# EasyEDA Pro project ProPrj_EIS-HW-V01_test_2026-05-23.epro, board PCB1
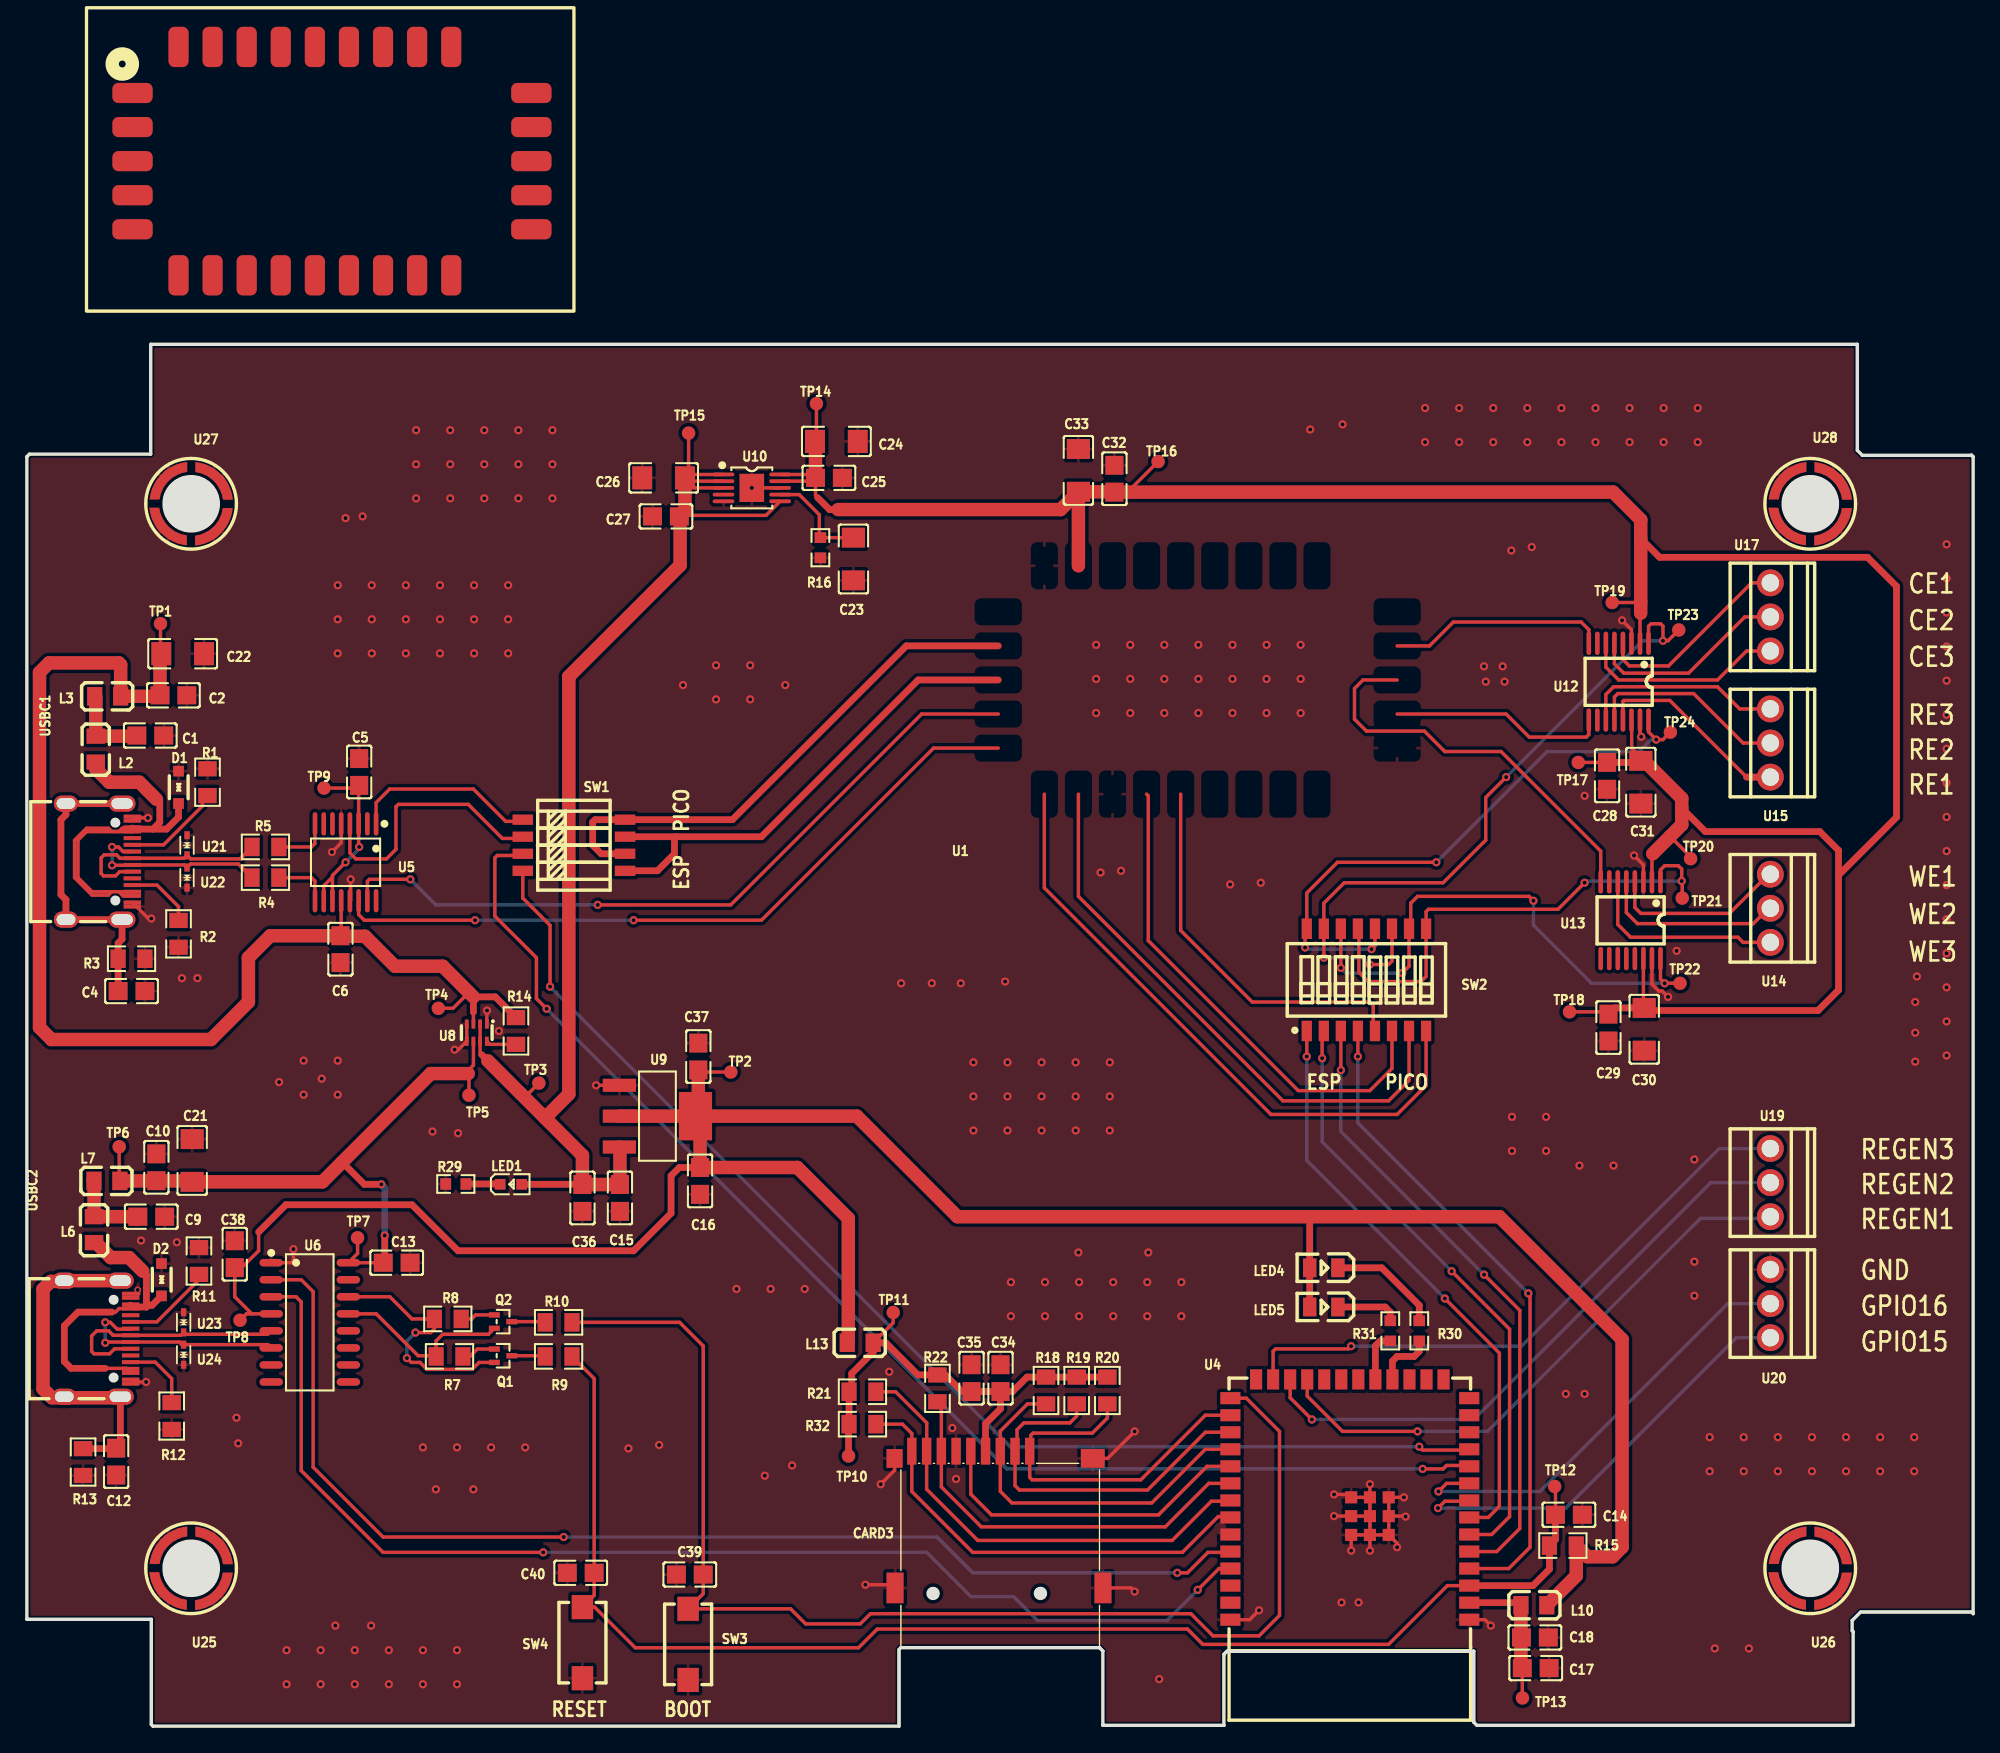
[diagram p5: board, top side]
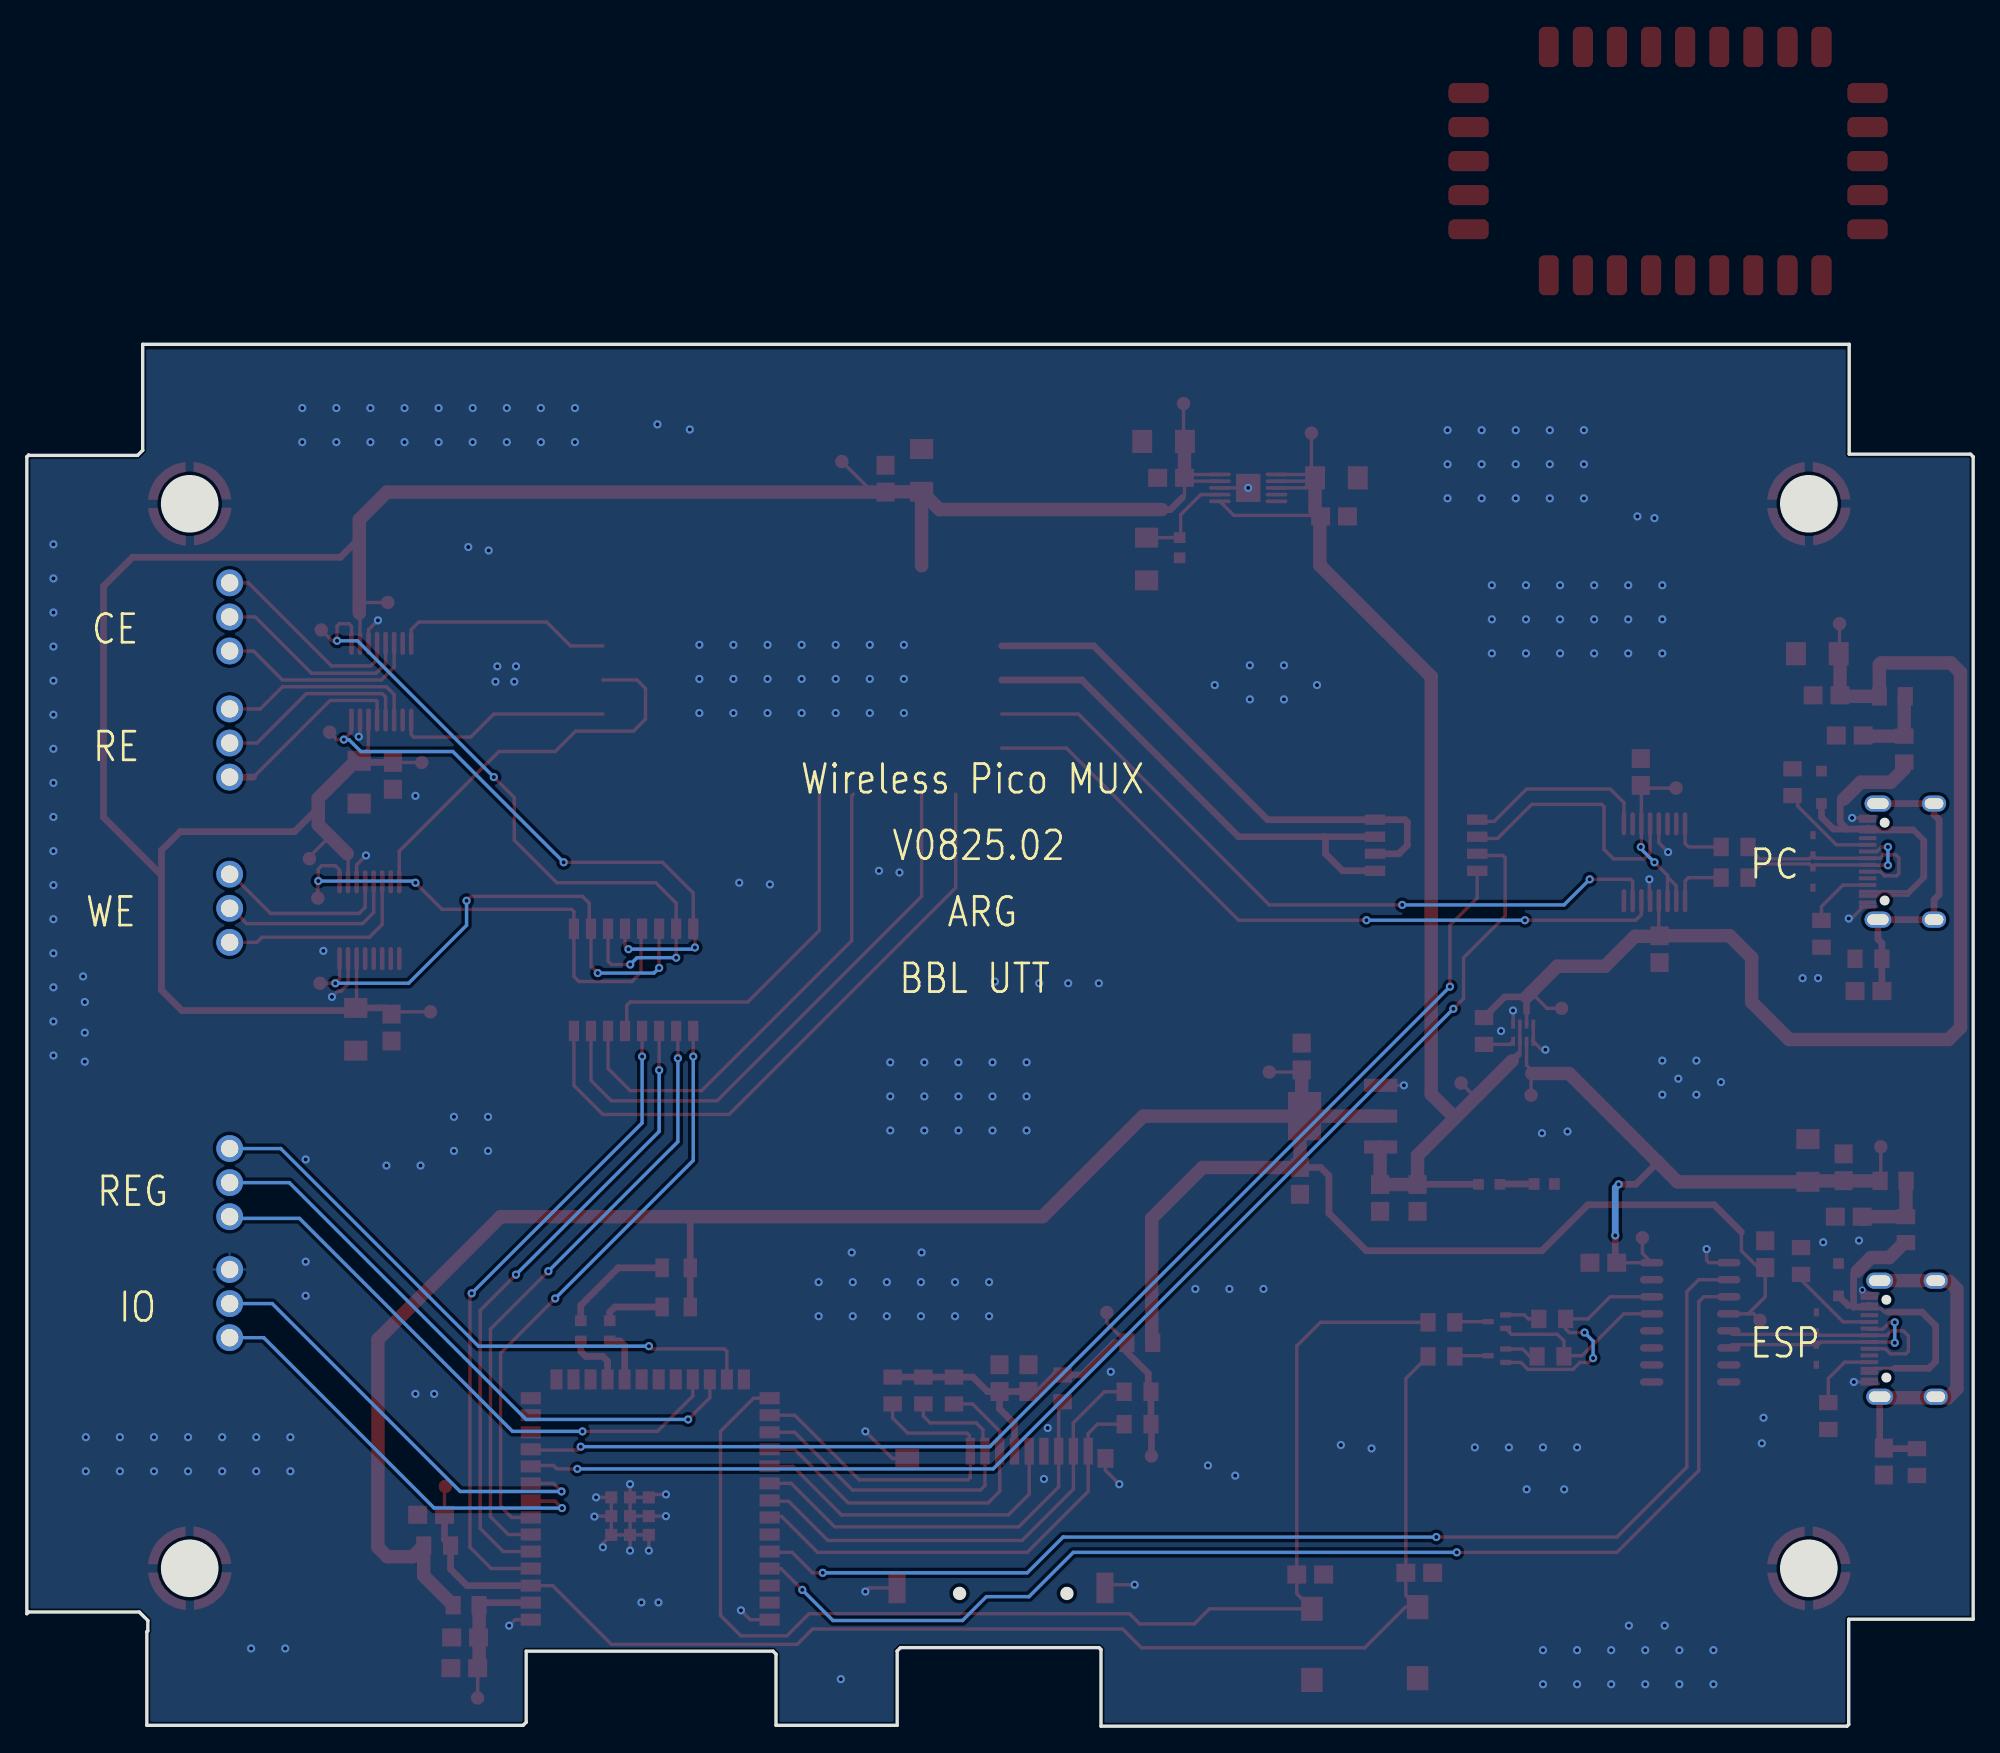
[diagram p6: board, bottom side, seen from below]

Outline 145.03 x 103 mm; copper layers: Top Layer, Bottom Layer. Coordinates in mm from the lower left corner of the outline.
Outline path: 0,94.62 0,7.97 9.27,7.97 9.27,0.13 9.4,0 64.99,0 64.99,5.71 65.13,5.85 79.93,5.85 80.18,5.6 80.18,0.06 89.21,0.06 89.21,5.36 89.43,5.59 107.82,5.59 107.82,0.29 108.05,0.06 136.09,0.06 136.09,7.04 136.02,7.11 136.02,7.87 136.65,8.51 144.91,8.51 145.03,8.38 145.03,94.62 144.91,94.74 144.88,94.72 136.78,94.72 136.4,95.1 136.4,103 9.23,103 9.23,94.81 0.19,94.81 0,94.62
Stack: Top Layer 0.035mm / Dielectric1 1.51mm FR4 er 4.5 / Bottom Layer 0.035mm

## Design rules (mm)
template: JLCPCB Capability(Two Layers Board)
spacing copperThickness1oz (default): track to track 0.102, other pairs 0.152 to 0.3
spacing copperThickness2oz: track to track 0.203, other pairs 0.152 to 0.3
track width copperThickness1oz (default): min 0.127, default 0.254, max 2.54
track width copperThickness2oz: min 0.203, default 0.254, max 2.54
differential pair differentialPair (default): width min 0.127, default 0.254, max 2.54; gap min 0.152, default 0.152
via viaSize (default): diameter min 0.5, default 0.61, max 10; hole min 0.3, default 0.305, max 6.3

## Placement (name value [footprint] x y rotation side)
C1  1uF  [C0805]  9.2 73.84 180 top
C2  100nF  [C0805]  10.92 76.84 180 top
C4  100nF  [C0805]  7.8 54.79 0 top
C5  100nF  [C0805]  24.77 71.12 270 top
C6  100nF  [C0805]  23.37 57.91 90 top
C9  1uF  [C0805]  9.27 37.97 180 top
C10  100nF  [C0805]  9.65 41.66 270 top
C12  100nF  [C0805]  6.66 19.72 270 top
C13  100nF  [C0805]  27.56 34.54 180 top
C14  1uF  [C0805]  114.91 15.76 180 top
C15  1uF  [C0805]  44.2 39.37 90 top
C16  4.7uF  [C0805]  50.16 40.64 90 top
C17  100nF  [C0805]  112.44 4.33 180 top
C18  10uF  [C0805]  112.37 6.61 180 top
C21  10uF  [C1206]  12.32 42.16 270 top
C22  10uF  [C1206]  11.61 79.94 180 top
C23  10uF  [C1206]  61.59 87 90 top
C24  22uF  [C1206]  60.32 95.76 180 top
C25  100nF  [C0805]  59.77 93.04 180 top
C26  10uF  [C1206]  47.45 93.04 0 top
C27  100nF  [C0805]  47.62 90.17 0 top
C28  100nF  [C0805]  117.75 70.83 90 top
C29  100nF  [C0805]  117.86 52.07 90 top
C30  10uF  [C1206]  120.52 51.94 90 top
C31  10uF  [C1206]  120.27 70.36 90 top
C32  100nF  [C0805]  81.04 92.98 90 top
C33  10uF  [C1206]  78.36 93.6 270 top
C34  100nF  [C0805]  72.55 25.94 270 top
C35  10uF  [C0805]  70.4 25.94 270 top
C36  100nF  [C0805]  41.4 39.37 90 top
C37  100nF  [C0805]  50.04 49.91 270 top
C38  100nF  [C0805]  15.49 35.18 270 top
C39  100nF  [C0805]  49.4 11.3 0 top
C40  100nF  [C0805]  41.28 11.43 0 top
CARD3  TF-015  [TF-SMD_TF-015]  72.43 15.4 0 top
D1  PESD5V0S1BA,115  [SOD-323_L1.7-W1.3-LS2.5-BI]  11.3 69.98 270 top
D2  PESD5V0S1BA,115  [SOD-323_L1.7-W1.3-LS2.5-BI]  10.03 33.27 270 top
L2  MPZ2012S601ATD25  [L0805]  5.14 72.82 90 top
L3  MPZ2012S601ATD25  [L0805]  6.02 76.76 0 top
L6  MPZ2012S601ATD25  [L0805]  5.01 37.01 90 top
L7  MPZ2012S601ATD25  [L0805]  5.97 40.64 0 top
L10  MPZ2012S601ATD25  [L0805]  112.3 9.02 180 top
L13  MPZ2012S601ATD25  [L0805]  62.1 28.58 0 top
LED1  KT-0603R  [LED0603-RD]  36.07 40.39 0 top
LED4  KT-0805Y  [LED0805-R-RD]  96.65 34.16 180 top
LED5  KT-0805G  [LED0805-R-RD]  96.65 31.24 180 top
Q1  MMBT2222ATT1G  [SC-75-3_L1.6-W0.8-P1.00-LS1.6-BR]  35.49 27.61 180 top
Q2  MMBT2222ATT1G  [SC-75-3_L1.6-W0.8-P1.00-LS1.6-BR]  35.49 30.15 180 top
R1  5.1kΩ  [R0805]  13.46 70.36 270 top
R2  5.1kΩ  [R0805]  11.3 59.06 90 top
R3  100kΩ  [R0805]  7.8 57.2 0 top
R4  27Ω  [R0805]  17.78 63.25 0 top
R5  27Ω  [R0805]  17.78 65.53 0 top
R7  10kΩ  [R0805]  31.5 27.56 0 top
R8  10kΩ  [R0805]  31.37 30.35 0 top
R9  0Ω  [R0805]  39.62 27.56 0 top
R10  0Ω  [R0805]  39.62 30.1 0 top
R11  5.1kΩ  [R0805]  12.83 34.67 270 top
R12  5.1kΩ  [R0805]  10.8 23.11 90 top
R13  100kΩ  [R0805]  4.19 19.69 270 top
R14  10kΩ  [R0805]  36.45 51.82 90 top
R15  10kΩ  [R0805]  114.46 13.46 0 top
R16  40kΩ  [R0603]  59.13 87.84 90 top
R18  10kΩ  [R0805]  75.95 25.02 90 top
R19  10kΩ  [R0805]  78.23 25.02 90 top
R20  10kΩ  [R0805]  80.52 25.02 90 top
R21  10kΩ  [R0805]  62.27 24.92 180 top
R22  10kΩ  [R0805]  67.85 25.18 90 top
R29  1kΩ  [R0603]  31.97 40.41 0 top
R30  1kΩ  [R0603]  103.76 29.46 90 top
R31  1kΩ  [R0603]  101.6 29.46 90 top
R32  10kΩ  [R0805]  62.27 22.51 180 top
SW1  DSHP04TSGET  [SW-SMD_8P-L6.7-W5.4-P1.27-LS8.4]  40.77 65.66 270 top
SW2  DSHP08TSGET  [SW-SMD_DSHP08TSGET]  99.82 55.63 0 top
SW3  SKQMBBE010  [KEY-SMD_L6.0-W3.5-LS6.2]  49.28 6.1 270 top
SW4  SKQMBBE010  [KEY-SMD_L6.0-W3.5-LS6.2]  41.4 6.22 270 top
TP1  -  [Test-Point-0.5mm]  9.96 82.17 0 top
TP2  -  [Test-Point-0.5mm]  52.46 48.76 0 top
TP3  -  [Test-Point-0.5mm]  38.16 47.93 0 top
TP4  -  [Test-Point-0.5mm]  30.67 53.5 0 top
TP5  -  [Test-Point-0.5mm]  32.95 47.03 0 top
TP6  -  [Test-Point-0.5mm]  6.88 43.19 0 top
TP7  -  [Test-Point-0.5mm]  24.65 36.4 0 top
TP8  -  [Test-Point-0.5mm]  15.89 30.25 0 top
TP9  -  [Test-Point-0.5mm]  22.14 69.92 0 top
TP10  -  [Test-Point-0.5mm]  61.23 20.14 0 top
TP11  -  [Test-Point-0.5mm]  64.56 30.83 0 top
TP12  -  [Test-Point-0.5mm]  113.85 17.87 0 top
TP13  -  [Test-Point-0.5mm]  111.45 2.1 0 top
TP14  -  [Test-Point-0.5mm]  58.84 98.58 270 top
TP15  -  [Test-Point-0.5mm]  49.31 96.38 270 top
TP16  -  [Test-Point-0.5mm]  84.3 94.26 0 top
TP17  -  [Test-Point-0.5mm]  115.61 71.83 0 top
TP18  -  [Test-Point-0.5mm]  114.96 53.24 0 top
TP19  -  [Test-Point-0.5mm]  118.14 83.75 0 top
TP20  -  [Test-Point-0.5mm]  123.98 64.66 0 top
TP21  -  [Test-Point-0.5mm]  123.35 61.72 0 top
TP22  -  [Test-Point-0.5mm]  123.19 55.37 0 top
TP23  -  [Test-Point-0.5mm]  123.1 81.71 0 top
TP24  -  [Test-Point-0.5mm]  122.47 74.09 270 top
U1  EmStat Pico  [Emstat-Pico]  72.39 72.9 0 top
U4  2.4GHz  [WIFIM-SMD_ESP32-S3-WROOM-1-N8]  98.58 16.89 180 top
U5  FT230XS-U  [SSOP-16_L5.0-W4.4-P0.65-LS6.4-BL]  23.75 64.39 180 top
U6  CH340C  [SOP-16_L10.0-W3.9-P1.27-LS6.0-BL]  21.08 30.1 270 top
U8  LM66200DRLR  [SOT-583-8_L2.1-W1.2-P0.50-LS1.6-BL]  33.53 51.69 180 top
U9  LDL1117S33R  [SOT-223-4_L6.5-W3.5-P2.30-LS7.0-BR]  46.99 45.47 180 top
U10  LT3042EMSE#TRPBF  [MSOP-10_L3.0-W3.0-P0.50-LS5.0-BL-EP]  54.02 92.29 270 top
U12  TMUX1109PWR  [TSSOP-16_L5.0-W4.4-P0.64-LS6.4-BL]  118.62 77.85 180 top
U13  TMUX1109PWR  [TSSOP-16_L5.0-W4.4-P0.64-LS6.4-BL]  119.51 60.07 180 top
U14  KF128-2.54-3P  [CONN-TH_3P-P2.54_KF128-2.54-3P]  129.92 60.96 90 top
U15  KF128-2.54-3P  [CONN-TH_3P-P2.54_KF128-2.54-3P]  129.92 73.28 90 top
U17  KF128-2.54-3P  [CONN-TH_3P-P2.54_KF128-2.54-3P]  129.92 82.68 90 top
U19  KF128-2.54-3P  [CONN-TH_3P-P2.54_KF128-2.54-3P]  129.92 40.51 90 top
U20  KF128-2.54-3P  [CONN-TH_3P-P2.54_KF128-2.54-3P]  129.92 31.5 90 top
U21  BNLESD5D5.0CT1G  [SOD-523_L1.2-W0.8-LS1.6-BI]  11.94 65.66 270 top
U22  BNLESD5D5.0CT1G  [SOD-523_L1.2-W0.8-LS1.6-BI]  11.94 63.25 90 top
U23  BNLESD5D5.0CT1G  [SOD-523_L1.2-W0.8-LS1.6-BI]  11.68 30.1 270 top
U24  BNLESD5D5.0CT1G  [SOD-523_L1.2-W0.8-LS1.6-BI]  11.68 27.69 90 top
U25  PAD_D3.3_M3Screw_1  [SMD_BD5.5-D3.9]  12.24 11.77 0 top
U26  PAD_D3.3_M3Screw_1  [SMD_BD5.5-D3.9]  132.89 11.77 0 top
U27  PAD_D3.3_M3Screw_1  [SMD_BD5.5-D3.9]  12.24 91.11 0 top
U28  PAD_D3.3_M3Screw_1  [SMD_BD5.5-D3.9]  132.89 91.11 0 top
USBC1  TYPE-C-31-M-12  [USB-C_SMD-TYPE-C-31-M-12]  5.39 64.44 270 top
USBC2  TYPE-C-31-M-12  [USB-C_SMD-TYPE-C-31-M-12]  5.26 28.88 270 top

## Footprints (pads in the part's own frame, mm; a bottom-side part is the same pattern mirrored in y, then rotated)
C0805
  rect 1.41x1.35 smd: 1(-1,0) 2(1,0)
C1206
  rect 1.485x1.728 smd: 1(-1.593,0) 2(1.593,0)
CONN-TH_3P-P2.54_KF128-2.54-3P
  round 2 hole 1.3: 1(-2.54,0) 2(0,0) 3(2.54,0)
Emstat-Pico
  rrect 3x1.5 smd: 1(-64.516,48.831) 2(-64.516,46.291) 3(-64.516,43.752) 4(-64.516,41.212) 5(-64.516,38.672) 15(-34.796,38.672) 16(-34.796,41.212) 17(-34.796,43.752) 18(-34.796,46.291) 19(-34.796,48.831)
  rrect 1.5x3 smd: 6(-61.087,35.242) 7(-58.547,35.242) 8(-56.007,35.242) 9(-53.467,35.242) 10(-50.926,35.242) 11(-48.386,35.242) 12(-45.846,35.242) 13(-43.306,35.242) 14(-40.767,35.242) 20(-40.767,52.261) 21(-43.306,52.261) 22(-45.846,52.261) 23(-48.386,52.261) 24(-50.926,52.261) 25(-53.467,52.261) 26(-56.007,52.261) 27(-58.547,52.261) 28(-61.087,52.261)
KEY-SMD_L6.0-W3.5-LS6.2
  rect 1.8x1.6 smd: 1(-2.65,0) 2(2.65,0)
L0805
  rect 1.133x1.377 smd: 1(-0.966,0) 2(0.966,0)
LED0603-RD
  rect 0.8x0.8 smd: 1(-0.799,0) 2(0.799,0)
LED0805-R-RD
  rect 1x1.399 smd: 1(1.05,0) 2(-1.05,0)
MSOP-10_L3.0-W3.0-P0.50-LS5.0-BL-EP
  oval 0.28x1.62 smd: 1(-1,-2.11) 2(-0.5,-2.11) 3(0,-2.11) 4(0.5,-2.11) 5(1,-2.11) 6(1,2.11) 7(0.5,2.11) 8(0,2.11) 9(-0.5,2.11) 10(-1,2.11)
  rect 2.1x1.83 smd: 11(0,0)
R0603
  rect 0.806x0.864 smd: 1(-0.753,0) 2(0.753,0)
R0805
  rect 1.133x1.377 smd: 1(-1,0) 2(1,0)
SC-75-3_L1.6-W0.8-P1.00-LS1.6-BR
  rect 0.816x0.4 smd: 1(0.65,-0.5) 2(0.65,0.5) 3(-0.65,0)
SMD_BD5.5-D3.9
  custom 0x0 smd: 1(-1.714,-2.131) 1(-1.691,2.155) 1(1.701,-2.155) 1(1.714,2.141)
SOD-323_L1.7-W1.3-LS2.5-BI
  rect 0.8x0.8 smd: 1(-1.205,0) 2(1.205,0)
SOD-523_L1.2-W0.8-LS1.6-BI
  rect 0.6x0.4 smd: 1(-0.75,0) 2(0.75,0)
SOP-16_L10.0-W3.9-P1.27-LS6.0-BL
  oval 0.56x1.745 smd: 1(-4.445,-2.873) 2(-3.175,-2.873) 3(-1.905,-2.873) 4(-0.635,-2.873) 5(0.635,-2.873) 6(1.905,-2.873) 7(3.175,-2.873) 8(4.445,-2.873) 9(4.445,2.873) 10(3.175,2.873) 11(1.905,2.873) 12(0.635,2.873) 13(-0.635,2.873) 14(-1.905,2.873) 15(-3.175,2.873) 16(-4.445,2.873)
SOT-223-4_L6.5-W3.5-P2.30-LS7.0-BR
  rect 2.47x0.98 smd: 1(2.835,-2.3) 2(2.835,0) 3(2.835,2.3)
  rect 2.47x3.6 smd: 4(-2.835,0)
SOT-583-8_L2.1-W1.2-P0.50-LS1.6-BL
  rect 0.28x0.68 smd: 1(-0.75,-0.64) 2(-0.25,-0.64) 3(0.25,-0.64) 4(0.75,-0.64) 5(0.75,0.64) 6(0.25,0.64) 7(-0.25,0.64) 8(-0.75,0.64)
SSOP-16_L5.0-W4.4-P0.65-LS6.4-BL
  oval 0.343x1.732 smd: 1(-2.275,-2.866) 2(-1.625,-2.866) 3(-0.975,-2.866) 4(-0.325,-2.866) 5(0.325,-2.866) 6(0.975,-2.866) 7(1.625,-2.866) 8(2.275,-2.866) 9(2.275,2.866) 10(1.625,2.866) 11(0.975,2.866) 12(0.325,2.866) 13(-0.325,2.866) 14(-0.975,2.866) 15(-1.625,2.866) 16(-2.275,2.866)
SW-SMD_8P-L6.7-W5.4-P1.27-LS8.4
  rect 0.762x1.524 smd: 1(-1.905,-3.81) 2(-0.635,-3.81) 3(0.635,-3.81) 4(1.905,-3.81) 5(1.905,3.81) 6(0.635,3.81) 7(-0.635,3.81) 8(-1.905,3.81)
SW-SMD_DSHP08TSGET
  rect 0.762x1.524 smd: 1(-4.445,-3.81) 2(-3.175,-3.81) 3(-1.905,-3.81) 4(-0.635,-3.81) 5(0.635,-3.81) 6(1.905,-3.81) 7(3.175,-3.81) 8(4.445,-3.81) 9(4.445,3.81) 10(3.175,3.81) 11(1.905,3.81) 12(0.635,3.81) 13(-0.635,3.81) 14(-1.905,3.81) 15(-3.175,3.81) 16(-4.445,3.81)
Test-Point-0.5mm
  round 1 smd: 1(0,0)
TF-SMD_TF-015
  rect 0.7x2 smd: 1(2.303,5.095) 2(1.21,5.093) 3(0.113,5.095) 4(-0.987,5.095) 5(-2.085,5.095) 6(-3.183,5.095) 7(-4.28,5.095) 8(-5.378,5.095) 9(-6.482,5.095)
  rect 1.2x1.397 smd: 10(-7.764,4.557)
  rect 1.27x2.286 smd: 11(-7.729,-5.095) 12(7.764,-5.095)
  rect 1.778x1.397 smd: 13(7.003,4.557)
TSSOP-16_L5.0-W4.4-P0.64-LS6.4-BL
  oval 0.343x1.732 smd: 1(-2.226,-2.862) 2(-1.59,-2.862) 3(-0.954,-2.862) 4(-0.318,-2.862) 5(0.318,-2.862) 6(0.954,-2.862) 7(1.59,-2.862) 8(2.226,-2.862) 9(2.226,2.862) 10(1.59,2.862) 11(0.954,2.862) 12(0.318,2.862) 13(-0.318,2.862) 14(-0.954,2.862) 15(-1.59,2.862) 16(-2.226,2.862)
USB-C_SMD-TYPE-C-31-M-12
  oval 1.2x2 hole 0.8x1.6: 0(-4.325,1.706) 1(4.325,1.706)
  oval 1.2x1.8 hole 0.8x1.4: 2(4.325,-2.474) 3(-4.325,-2.474)
  rect 0.3x1.3 smd: A1(-3.35,2.474) A4(-2.55,2.474) A5(-1.25,2.474) A6(-0.25,2.474) A7(0.25,2.474) A8(1.25,2.474) A9(2.55,2.474) A12(3.35,2.474) B1(3.05,2.474) B4(2.25,2.474) B5(1.75,2.474) B6(0.75,2.474) B7(-0.75,2.474) B8(-1.75,2.474) B9(-2.25,2.474) B12(-3.05,2.474)
WIFIM-SMD_ESP32-S3-WROOM-1-N8
  rect 1.5x0.9 smd: 1(-8.9,8.954) 2(-8.9,7.684) 3(-8.9,6.415) 4(-8.9,5.144) 5(-8.9,3.874) 6(-8.9,2.604) 7(-8.9,1.335) 8(-8.9,0.065) 9(-8.9,-1.206) 10(-8.9,-2.475) 11(-8.9,-3.745) 12(-8.9,-5.016) 13(-8.9,-6.285) 14(-8.9,-7.556) 27(8.9,-7.556) 28(8.9,-6.285) 29(8.9,-5.016) 30(8.9,-3.745) 31(8.9,-2.475) 32(8.9,-1.206) 33(8.9,0.065) 34(8.9,1.335) 35(8.9,2.604) 36(8.9,3.874) 37(8.9,5.144) 38(8.9,6.415) 39(8.9,7.684) 40(8.9,8.954)
  rect 0.9x1.5 smd: 15(-6.985,-8.954) 16(-5.715,-8.954) 17(-4.445,-8.954) 18(-3.175,-8.954) 19(-1.905,-8.954) 20(-0.635,-8.954) 21(0.635,-8.954) 22(1.905,-8.954) 23(3.175,-8.954) 24(4.445,-8.954) 25(5.715,-8.954) 26(6.985,-8.954)
  rect 0.9x0.9 smd: 41(-2.9,2.635) 41(-2.9,1.235) 41(-2.9,-0.165) 41(-1.5,2.635) 41(-1.5,1.235) 41(-1.5,-0.165) 41(-0.1,2.635) 41(-0.1,1.235) 41(-0.1,-0.165)

## Nets
As in the schematic.

Pads without a net: U1 1 11 12 13 14 19 20 21 22 23 24 25 26; U4 12 13 14 15 16 17 20 21 22 26 35 38 39; U5 2 6 7 16; U6 7 8 9 10 11 12 15; U10 4; U12 7 10; U13 7 9 10 11 12 13; USBC1 A8 B8; USBC2 A8 B8

## Via types
v1: diameter 0.61, hole 0.305, Top Layer to Bottom Layer, 299 vias
v2: diameter 0.5, hole 0.3, Top Layer to Bottom Layer, 1 via

## Routing (per net, layer and track width the routed paths; a pad name or vN(x,y) marks a point on that pad's centre or on a via; arc(x,y) is an arc through that point)
+3V3: length 194.6
  Top Layer w0.254: 16.76,30.73 16.37,30.73 TP8.1 ; 16.76,30.73 18.21,30.73 ; 16.76,30.73 15.49,32 C38.2 16.02,34.18 17.27,35.43 17.27,36.83 ; C37.2 50.19,48.76 TP2.1
  Top Layer w0.5: 17.27,36.83 19.3,38.86 28.7,38.86 32.13,35.43 45.21,35.43 48.01,38.23 48.01,41.02 48.62,41.64 C16.2 ; LED5.1 LED4.1 95.6,37.82 95.75,37.97
  Top Layer w1: U9.4 50.16,45.13 50.16,41.77 ; U9.4 61.85,45.47 69.34,37.97 109.73,37.97 118.87,28.83 118.87,13.34 118.16,12.63 116.29,12.63 R15.2 115.46,11.21 L10.1 ; U9.4 50.04,45.68 C37.2 ; U9.4 U9.2 ; C16.2 57.42,41.64 61.21,37.85 61.21,28.65 L13.1
+4V: length 209.6
  Top Layer w0.254: TP14.1 58.84,95.86 C24.2 ; TP17.1 C28.2 ; U13.14 120.46,53.6 ; TP16.1 82.02,91.98 ; U10.9 58.27,92.79 58.77,93.29 U10.10 ; C29.2 117.68,53.24 TP18.1 ; U13.2 121.1,64.96 ; C25.2 58.77,91.73 58.93,91.57 ; 120.26,83.8 120.22,83.75 TP19.1 ; 122.45,66.32 123.98,64.79 TP20.1 ; 120.27,72.2 119.59,72.89 119.59,74.98 U12.14 ; U12.2 120.21,82.88 120.27,82.94
  Top Layer w0.5: 135,63.42 135,54.86 133.48,53.34 120.72,53.34 C30.2 118.32,53.54 C29.2 ; 135,63.42 139.32,67.74 139.32,84.96 137.16,87.12 121.67,87.12 120.01,88.77 ; 135,63.42 135,65.28 133.6,66.68 125.08,66.68 123.32,68.44 ; 120.26,82.95 120.27,82.94 ; 120.27,72.2 119.9,71.83 C28.2 ; 58.93,91.57 59.82,90.68 60.45,90.68
  Top Layer w1: C24.2 58.77,95.72 C25.2 ; 120.26,82.95 120.26,89.92 118.21,91.98 C32.1 81.02,92.01 C33.2 77.03,90.68 60.45,90.68 ; 120.27,72.2 123.32,69.16 123.32,67.18 121.16,65.02 ; 78.36,86.49 78.36,92.01
+5V: length 98.3
  Top Layer w0.254: 49.29,93.29 49.31,93.31 TP15.1 ; 49.29,93.29 C26.2 ; 49.29,93.29 U10.1 ; 36.77,47.18 37.4,47.18 TP3.1 ; U10.2 49.29,92.79 49.79,92.29 U10.3 ; U10.6 55.09,90.25 48.7,90.25 ; U8.2 U8.7 33.78,50.04
  Top Layer w0.5: LED1.2 41.39,40.39 C36.2 ; 33.91,50.04 34.35,49.59
  Top Layer w1: U9.3 44.2,43.13 C15.2 C36.2 41.4,42.55 38.61,45.34 ; 34.35,49.59 38.61,45.34 ; C26.2 49.04,90.59 C27.2 ; 38.61,45.34 40.39,47.11 40.39,78.23 48.68,86.53 48.68,90.17
+5V_USB1: length 94.3
  Top Layer w0.254: U5.12 23.42,58.97 C6.2 ; 32.94,54.69 31.75,53.5 TP4.1 ; U8.3 33.28,53.21 ; C22.2 9.96,80 TP1.1
  Top Layer w0.5: 33.27,54.36 34.91,54.36 R14.2 ; 33.28,53.21 33.28,54.35
  Top Layer w1: 9.72,76.76 L3.2 6.99,79.12 6.86,79.25 1.65,79.25 0.94,78.54 0.94,52.07 1.83,51.18 13.72,51.18 16.51,53.98 16.51,57.28 18.14,58.91 C6.2 23.41,58.87 25.2,58.87 27.43,56.64 30.99,56.64 33.27,54.36 ; C22.2 9.92,79.84 C2.2
+5V_USB2: length 50.4
  Top Layer w0.254: TP5.1 32.95,48.93 33.28,49.26 U8.6 ; 6.94,40.64 6.88,40.69 TP6.1 ; TP7.1 24.65,35.24 U6.16 26.43,34.54
  Top Layer w0.5: v1(26.67,36.58) 26.67,34.66 C13.2 ; 32.89,48.64 32.89,48.66 32.95,48.71 ; 23.5,42.04 25.15,40.39 v1(26.42,40.39)
  Top Layer w1: 6.94,40.64 12.25,40.64 C21.2 22.03,40.57 30.1,48.64 32.89,48.64
  Bottom Layer w0.5: v1(26.67,36.58) 26.67,40.13 v1(26.42,40.39)
GND: length 64.2
  Top Layer w0.254: 64.7,10.3 64.46,10.54 v1(62.48,10.54) ; v1(97.41,17.27) 98.47,17.27 U4.41 U4.41 ; U12.15 120.21,73.84 v1(120.3,73.75) ; CARD3.12 82.28,10.3 v1(82.55,10.03) ; v1(34.29,53.34) 34.28,53.33 U8.1 ; USBC2.B1 7.91,25.65 v1(8.89,25.65) ; U4.41 102.11,13.63 v1(102.11,13.34) ; U4.41 U4.41 ; U4.41 U4.41 ; v1(109.09,7.49) 108.65,7.94 U4.1 ; U4.41 U4.41 v1(102.62,17.06) ; U4.41 102.71,15.66 v1(102.74,15.62) ; U4.41 U4.41 v1(98.68,13.08) ; U4.41 v1(100.08,13.08) ; U4.41 U4.41 ; v1(54.02,92.29) U10.8 ; U8.4 U8.5 32.15,50.42 v1(31.88,50.42) ; v1(118.87,82.42) 119.57,81.72 U12.3 ; U9.1 v1(42.42,47.77) ; v1(91.82,8.64) 91.12,7.94 U4.40 ; v1(97.41,15.66) U4.41 U4.41 ; v1(122.3,54.36) 121.87,54.79 121.62,54.79 121.1,55.31 U13.15 ; U4.41 U4.41 ; USBC2.A1 8.33,32.23 8.26,32.3 v2(8.26,32.51) ; U5.13 24.13,61.58 v1(24.13,63.12) ; v1(22.73,65.15) 23.42,65.84 U5.5 ; v1(119.76,64.9) 120.46,64.2 U13.3 ; v1(9.02,67.7) 8.07,67.7 USBC1.B12 ; v1(19.86,35.56) 19.86,34.72 19.69,34.54 U6.1 ; U4.41 v1(100.08,18.03) ; v1(63.63,18.03) 64.66,19.07 CARD3.10 ; v1(9.27,60.2) 9.06,60.2 USBC1.B1 ; CARD3.13 80.53,19.96 v1(82.55,21.97)
  vias: v1(8.51,36.2) v1(11.18,36.07) v1(11.56,55.75) v1(12.71,55.75) v1(15.62,22.99) v1(15.75,21.08) v1(18.8,48.01) v1(19.36,5.66) v1(19.36,3.12) v1(20.62,49.61) v1(20.62,47.07) v1(21.89,5.66) v1(21.89,3.12) v1(21.97,48.26) v1(22.99,7.49) v1(23.17,85.04) v1(23.17,82.5) v1(23.17,79.96) v1(23.17,49.61) v1(23.17,47.07) v1(23.75,90.04) v1(24.44,5.66) v1(24.44,3.12) v1(25.02,90.17) v1(25.7,85.04) v1(25.7,82.5) v1(25.7,79.96) v1(25.65,7.49) v1(26.97,5.66) v1(26.97,3.12) v1(28.25,85.04) v1(28.25,82.5) v1(28.25,79.96) v1(29.01,96.6) v1(29.01,94.06) v1(29.01,91.52) v1(29.52,20.78) v1(29.52,5.66) v1(29.52,3.12) v1(30.23,44.32) v1(30.48,17.65) v1(30.78,85.04) v1(30.78,82.5) v1(30.78,79.96) v1(31.55,96.6) v1(31.55,94.06) v1(31.55,91.52) v1(32.13,44.2) v1(32.06,20.78) v1(32.06,5.66) v1(32.06,3.12) v1(33.33,85.04) v1(33.33,82.5) v1(33.33,79.96) v1(33.27,17.65) v1(34.09,96.6) v1(34.09,94.06) v1(34.09,91.52) v1(34.59,20.78) v1(35.18,51.82) v1(35.86,85.04) v1(35.86,82.5) v1(35.86,79.96) v1(36.63,96.6) v1(36.63,94.06) v1(36.63,91.52) v1(37.14,20.78) v1(39.17,96.6) v1(39.17,94.06) v1(39.17,91.52) v1(44.83,20.7) v1(47.12,20.96) v1(48.9,77.6) v1(51.36,79.07) v1(51.36,76.53) v1(52.88,32.59) v1(53.9,79.07) v1(53.9,76.53) v1(54.99,18.67) v1(55.42,32.59) v1(56.51,77.6) v1(57.02,19.43) v1(57.96,32.59) v1(64.26,26.42) v1(65.15,55.37) v1(67.44,55.37) v1(68.96,22.23) v1(69.24,18.42) v1(69.6,55.37) v1(70.54,49.48) v1(70.54,46.94) v1(70.54,44.4) v1(72.9,55.5) v1(73.08,49.48) v1(73.08,46.94) v1(73.08,44.4) v1(73.33,33.1) v1(73.33,30.56) v1(75.62,49.48) v1(75.62,46.94) v1(75.62,44.4) v1(75.87,33.1) v1(75.87,30.56) v1(78.16,49.48) v1(78.16,46.94) v1(78.16,44.4) v1(78.36,35.31) v1(78.41,33.1) v1(78.41,30.56) v1(79.68,80.59) v1(79.68,78.05) v1(79.68,75.51) v1(80.01,63.63) v1(80.7,49.48) v1(80.7,46.94) v1(80.7,44.4) v1(80.95,33.1) v1(80.95,30.56) v1(81.53,63.75) v1(82.22,80.59) v1(82.22,78.05) v1(82.22,75.51) v1(83.49,33.1) v1(83.49,30.56) v1(83.57,35.31) v1(84.38,3.51) v1(84.76,80.59) v1(84.76,78.05) v1(84.76,75.51) v1(86.03,33.1) v1(86.03,30.56) v1(87.3,80.59) v1(87.3,78.05) v1(87.3,75.51) v1(89.66,62.74) v1(89.84,80.59) v1(89.84,78.05) v1(89.84,75.51) v1(91.95,62.87) v1(92.38,80.59) v1(92.38,78.05) v1(92.38,75.51) v1(94.92,80.59) v1(94.92,78.05) v1(94.92,75.51) v1(95.63,96.65) v1(98.04,97.03) v1(97.97,9.22) v1(99.24,9.22) v1(104.19,98.25) v1(104.19,95.71) v1(106.73,98.25) v1(106.73,95.71) v1(108.59,78.99) v1(108.71,77.85) v1(109.27,98.25) v1(109.27,95.71) v1(109.97,78.99) v1(110.11,77.85) v1(110.62,87.63) v1(110.67,45.42) v1(110.67,42.88) v1(111.81,98.25) v1(111.81,95.71) v1(112.14,87.88) v1(113.21,45.42) v1(113.21,42.88) v1(114.35,98.25) v1(114.35,95.71) v1(114.68,24.77) v1(115.7,41.78) v1(116.08,69.34) v1(116.08,24.77) v1(116.89,98.25) v1(116.89,95.71) v1(118.24,41.78) v1(119.43,98.25) v1(119.43,95.71) v1(121.97,98.25) v1(121.97,95.71) v1(122.94,57.79) v1(124.26,42.24) v1(124.26,34.62) v1(124.26,32.08) v1(124.51,98.25) v1(124.51,95.71) v1(125.4,21.54) v1(125.4,19) v1(125.78,5.79) v1(127.94,21.54) v1(127.94,19) v1(128.32,5.79) v1(130.48,21.54) v1(130.48,19) v1(133.02,21.54) v1(133.02,19) v1(135.56,21.54) v1(135.56,19) v1(138.1,21.54) v1(138.1,19) v1(140.64,21.54) v1(140.64,19) v1(140.72,53.98) v1(140.72,51.69) v1(140.72,49.53) v1(140.84,55.88) v1(143.05,88.09) v1(143.05,85.55) v1(143.05,83.01) v1(143.05,80.47) v1(143.05,77.93) v1(143.05,75.39) v1(143.05,72.85) v1(143.05,70.31) v1(143.05,67.77) v1(143.05,65.23) v1(143.05,62.69) v1(143.05,60.15) v1(143.05,57.61) v1(143.05,55.07) v1(143.05,52.53) v1(143.05,49.99)
VBUS1: length 37.1
  Top Layer w0.254: 6.87,62.19 7.17,61.89 USBC1.A9 ; 6.87,62.19 6.87,62.2 6.32,62.2 6.32,62.19 ; 6.87,62.19 USBC1.B4 ; 6.32,62.19 6.07,61.94 4.86,61.94 3.56,63.25 3.56,66.04 4.44,66.93 6.08,66.93 6.32,66.69 6.87,66.69 7.11,66.93 7.8,66.93 USBC1.A4 ; 6.32,62.19 4.86,62.19 3.81,63.25 3.81,66.04 4.44,66.68 7.85,66.68 USBC1.B9
  Top Layer w0.5: 9.4,66.86 10.41,66.86 11.3,67.75 D1.2 ; 9.4,66.86 9.91,67.37 9.91,69.09 ; 9.4,66.86 7.94,66.86 7.86,66.94
  Top Layer w1: L2.1 5.14,71.36 6.14,70.36 8.38,70.36 9.65,69.09
VBUS2: length 23.8
  Top Layer w0.25: 7.44,26.63 USBC2.B4
  Top Layer w0.254: 6.35,30.86 6.6,30.86 6.87,31.13 7.43,31.13 USBC2.A4 ; USBC2.A9 7.4,26.67 5.84,26.67
  Top Layer w0.5: 6.35,30.86 3.81,30.86 2.79,29.85 2.79,27.18 3.3,26.67 5.84,26.67 ; D2.2 9.33,31.37 9.04,31.37 8.91,31.24 ; 8.91,31.24 8.91,33.63 8.64,33.91 ; 8.91,31.24 7.87,31.24 ; 7.86,31.26 7.74,31.38
  Top Layer w1: L6.1 5.14,36.04 6.25,34.93 7.62,34.93 8.64,33.91
VCC_SD: length 36.4
  Top Layer w0.254: TP11.1 64.56,30.07 63.07,28.58
  Top Layer w0.5: 72.55,24.94 69.68,24.94 68.44,26.18 R22.2 66.41,26.18 64.01,28.58 63.07,28.58 63.07,27.89 61.47,26.29 61.47,25.13 R21.2 R32.2 61.23,22.48 TP10.1 ; 72.55,24.94 72.55,23.66 71.44,22.55 CARD3.4 ; 72.55,24.94 73.45,24.94 74.53,26.02 R18.2 R19.2 R20.2
CE1: length 15
  Top Layer w0.254: U12.4 118.94,79.5 119.41,79.03 122.33,79.03 128.52,85.22 U17.3
CE2: length 15.2
  Top Layer w0.254: U12.5 118.3,79.19 119,78.49 123.82,78.49 128.02,82.68 U17.2
CE3: length 15.3
  Top Layer w0.254: U17.1 128.14,80.14 125.98,77.98 118.62,77.98 117.66,78.93 U12.6
CE_RE_MUX_0: length 52.2
  Top Layer w0.254: v1(110.24,70.74) 108.71,69.22 108.71,66.04 105.54,62.87 98.17,62.87 96.65,61.34 SW2.15 v1(96.65,57.28) ; v1(100.08,56.77) 101.47,56.77 101.73,57.02 SW2.11 ; U12.1 120.84,81.98 121.03,82.17 121.74,82.17 121.92,81.99 v1(121.92,80.9) 122.29,80.9 TP23.1
  Bottom Layer w0.254: v1(96.65,57.28) 99.57,57.28 v1(100.08,56.77) ; v1(110.24,70.74) 120.4,80.9 v1(121.92,80.9)
CE_RE_MUX_1: length 44.5
  Top Layer w0.254: v1(100.2,57.91) 100.46,58.17 SW2.12 ; U12.16 120.84,74.1 v1(121.41,73.53) 121.92,73.53 TP24.1 ; v1(95.25,58.04) 95.25,59.31 SW2.16 95.38,62.1 97.66,64.39 v1(105.03,64.39)
  Bottom Layer w0.254: v1(100.2,57.91) 95.38,57.91 v1(95.25,58.04) ; v1(121.41,73.53) 121.03,73.53 120.14,72.64 113.28,72.64 v1(105.03,64.39)
D+: length 15.7
  Top Layer w0.254: USBC1.B6 6.92,63.69 6.6,63.37 5.72,63.37 5.54,63.55 5.54,64.72 5.76,64.95 6.68,64.95 6.94,64.69 USBC1.A6 11.72,64.69 U21.2 12.2,64.64 15.89,64.64 R5.1
D-: length 14.1
  Top Layer w0.254: R4.1 15.76,64.26 12.2,64.26 U22.2 11.74,64.19 USBC1.A7 7.84,64.17 v1(6.35,64.17) ; USBC1.B7 7.17,65.19 6.83,65.53 v1(6.35,65.53)
  Bottom Layer w0.254: v1(6.35,64.17) v1(6.35,65.53)
DN: length 16.3
  Top Layer w0.254: 11.68,28.31 11.36,28.63 USBC2.A7 5.9,28.63 v1(5.84,28.58) ; U24.2 17.97,28.44 U6.6 ; USBC2.B7 7.7,29.59 6.73,29.59 6.22,30.1 v1(5.84,30.1)
  Bottom Layer w0.254: v1(5.84,28.58) v1(5.84,30.1)
DP: length 18.2
  Top Layer w0.254: USBC2.B6 6.54,28.13 6.16,27.75 5.02,27.75 4.83,27.94 4.83,29.08 5.21,29.46 6.1,29.46 6.43,29.13 USBC2.A6 11.47,29.13 U23.2 11.82,29.21 17.96,29.21 U6.5
DTR: length 13.7
  Top Layer w0.254: 30.42,27.61 29.16,27.61 26.03,30.73 23.95,30.73 ; R7.1 30.5,28.72 30.99,29.21 34.4,29.21 Q2.2
ESP_CE_RE_MUX_0: length 45.6
  Top Layer w0.254: U4.6 109.15,14.29 110.49,15.62 110.49,29.59 v1(106.17,33.91) ; v1(96.52,49.78) 96.52,51.69 SW2.2
  Bottom Layer w0.254: v1(106.17,33.91) 96.52,43.56 v1(96.52,49.78)
ESP_CE_RE_MUX_1: length 44
  Top Layer w0.254: v1(105.66,31.88) 109.73,27.81 109.73,16.38 108.9,15.56 U4.7 ; v1(95.38,49.91) SW2.1
  Bottom Layer w0.254: v1(105.66,31.88) 95.38,42.16 v1(95.38,49.91)
ESP_EN: length 102.8
  Top Layer w0.254: R9.2 42.28,25.91 C40.2 42.28,9.75 SW4.1 42.31,8.87 45.34,5.84 61.98,5.84 63.37,7.24 86.49,7.24 87.63,6.1 101.47,6.1 105.85,10.48 U4.3 ; C14.2 113.91,17.8 TP12.1
  Top Layer w0.5: C14.2 113.91,13.91 R15.1 113.46,11.7 112.24,10.48 U4.3
ESP_GPIO0: length 95.1
  Top Layer w0.254: U4.27 90.87,24.45 93.34,21.97 93.34,8.26 91.82,6.73 88.39,6.73 86.74,8.38 62.87,8.38 62.1,7.62 58.04,7.62 56.91,8.75 SW3.1 50.4,9.87 C39.2 50.4,28.34 48.64,30.1 R10.2
ESP_RX0: length 88.8
  Top Layer w0.254: U4.36 89.62,12.95 88.01,12.95 86.49,11.43 v1(85.72,11.43) ; U6.2 20.45,33.27 21.34,32.39 21.34,19.3 26.54,14.1 v1(40,14.1)
  Bottom Layer w0.254: v1(85.72,11.43) 70.49,11.43 67.82,14.1 v1(40,14.1)
ESP_RX_1: length 92.3
  Top Layer w0.254: v1(38.99,55.12) 38.99,59.69 36.96,61.72 SW1.4 ; U4.11 107.42,20.57 104.01,20.57 v1(103.76,20.83)
  Bottom Layer w0.254: v1(38.99,55.12) 73.28,20.83 v1(103.76,20.83)
ESP_TX0: length 90.4
  Top Layer w0.254: v1(87.25,10.16) 88.83,11.75 U4.37 ; v1(38.48,12.95) 26.54,12.95 20.45,19.05 20.45,31.62 20.07,32 U6.3
  Bottom Layer w0.254: v1(87.25,10.16) 84.96,7.87 75.31,7.87 73.53,9.65 70.36,9.65 67.06,12.95 v1(38.48,12.95)
ESP_TX_1: length 98.1
  Top Layer w0.254: SW1.3 36.83,64.9 35.05,64.9 34.87,64.72 34.87,60.38 37.97,57.28 37.97,54.23 v1(38.73,53.47) ; U4.10 107.42,19.43 105.79,19.43 105.54,19.18 v1(104.01,19.18)
  Bottom Layer w0.254: v1(38.73,53.47) 73.03,19.18 v1(104.01,19.18)
ESP_WE_MUX_0: length 49
  Top Layer w0.254: U4.4 110.42,11.75 112.01,13.34 112.01,32.13 v1(111.89,32.26) ; v1(99.19,49.91) SW2.4
  Bottom Layer w0.254: v1(111.89,32.26) 99.19,44.96 v1(99.19,49.91)
ESP_WE_MUX_1: length 47.1
  Top Layer w0.254: v1(108.59,33.66) 111.25,30.99 111.25,14.73 109.54,13.02 U4.5 ; v1(97.92,48.9) SW2.3
  Bottom Layer w0.254: v1(97.92,48.9) 97.92,44.32 v1(108.59,33.66)
FTDI_RX: length 19.8
  Top Layer w0.254: U5.4 24.07,65.08 24.51,64.64 26.8,64.64 27.51,65.35 27.51,68.53 27.69,68.71 32.89,68.71 35.43,66.17 36.96,66.17
FTDI_TX: length 13.9
  Top Layer w0.254: U5.1 26.02,68.83 27.04,69.85 33.27,69.85 35.69,67.44 36.96,67.44
IO15: length 32.6
  Top Layer w0.254: v1(105.16,16.26) 105.66,16.76 107.42,16.76 U4.8
  Bottom Layer w0.254: v1(105.16,16.26) 114.68,16.26 127.38,28.96 129.92,28.96
IO16: length 33.1
  Top Layer w0.254: v1(105.19,17.49) 105.79,18.1 U4.9
  Bottom Layer w0.254: v1(105.19,17.49) 112.74,17.49 126.75,31.5 U20.2
IO35: length 27.5
  Top Layer w0.254: U4.28 87.82,23.18 83.01,18.36 74.91,18.36 74.73,18.54 CARD3.1 74.8,20.57 74.8,21.66 74.98,21.84 79.4,21.84 80.52,22.97 R20.1
IO36: length 28
  Top Layer w0.254: R19.1 78.23,23.11 77.72,22.61 74.29,22.61 73.79,22.1 73.79,20.64 73.64,20.49 73.64,17.93 73.97,17.6 83.51,17.6 87.82,21.91 U4.29
IO37: length 27.9
  Top Layer w0.254: R18.1 74.56,24.02 72.54,21.99 CARD3.3 72.54,17.5 73.41,16.64 83.82,16.64 87.82,20.64 U4.30
IO38: length 24.7
  Top Layer w0.254: U4.31 87.95,19.37 84.33,15.75 71.88,15.75 70.34,17.29 CARD3.5
IO39: length 30.6
  Top Layer w0.254: U4.32 88.07,18.1 84.84,14.86 71.12,14.86 68.15,17.83 CARD3.7 68.15,23.89 67.85,24.18
IO40: length 35.2
  Top Layer w0.254: R21.1 64.74,24.92 67.06,22.61 67.06,20.5 CARD3.8 67.05,17.66 70.87,13.84 85.34,13.84 88.26,16.76 89.62,16.76 U4.33
LED_GREEN: length 3.8
  Top Layer w0.5: U4.19 100.49,28.35 100.85,28.71 R31.1
LED_YELLOW: length 4.4
  Top Layer w0.5: U4.18 101.76,27.21 102.11,27.56 103.38,27.56 103.76,27.94 R30.1
PICO_CE0: length 16.3
  Top Layer w0.254: U12.8 116.39,81.73 115.82,82.3 106.3,82.3 104.52,80.52 102.11,80.52
PICO_CE_RE_MUX_0: length 37.2
  Top Layer w0.254: 83.44,69.47 83.57,69.34 83.57,58.55 94.74,47.37 100.08,47.37 101.73,49.02 SW2.6
PICO_CE_RE_MUX_1: length 28.8
  Top Layer w0.254: SW2.5 100.33,51.94 100.33,53.72 100.08,53.98 91.31,53.98 85.98,59.31 85.98,69.47
PICO_DWNLD: length 55.2
  Top Layer w0.254: v1(28.58,63.12) 25.53,63.12 25.37,62.97 U5.15 ; 72.39,75.44 66.68,75.44 52.45,61.21 v1(42.55,61.21)
  Bottom Layer w0.254: v1(28.58,63.12) 30.48,61.21 v1(42.55,61.21)
PICO_RE0: length 16.2
  Top Layer w0.254: 102.11,75.44 110.24,75.44 111.95,73.72 116.21,73.72 116.39,73.91 U12.9
PICO_RESET: length 54.2
  Top Layer w0.254: v1(45.21,60.07) 54.74,60.07 67.56,72.9 72.39,72.9 ; U5.14 24.72,60.49 25.15,60.07 v1(33.4,60.07)
  Bottom Layer w0.254: v1(33.4,60.07) v1(45.21,60.07)
PICO_WE0: length 30.4
  Top Layer w0.254: U13.8 117.28,65.22 109.85,72.64 105.66,72.64 104.14,74.17 99.82,74.17 98.93,75.06 98.93,77.34 99.57,77.98 102.11,77.98
PICO_WE_MUX_0: length 47.4
  Top Layer w0.254: 75.82,69.47 75.82,62.48 92.71,45.59 102.11,45.59 104.27,47.75 SW2.8
PICO_WE_MUX_1: length 42.9
  Top Layer w0.254: SW2.7 103,48.13 101.47,46.61 93.6,46.61 78.36,61.85 78.36,69.47
RE1: length 14.8
  Top Layer w0.254: 128.14,70.74 122.43,76.45 119,76.45 118.94,76.39 U12.13
  Top Layer w0.5: 128.14,70.74 U15.1
RE2: length 15
  Top Layer w0.254: U12.12 118.3,76.71 118.55,76.96 124.21,76.96 127.89,73.28 U15.2
RE3: length 15.1
  Top Layer w0.254: U15.3 127.63,75.82 125.98,77.47 118.24,77.47 117.66,76.9 U12.11
REGEN_1: length 43.5
  Top Layer w0.254: U4.23 95.41,24.61 98.04,21.97 v1(103.63,21.97)
  Bottom Layer w0.254: U19.1 129.79,37.85 124.71,37.85 108.84,21.97 v1(103.63,21.97)
REGEN_2: length 45.1
  Top Layer w0.254: U4.24 94.14,24.48 v1(95.76,22.86)
  Bottom Layer w0.254: v1(95.76,22.86) 107.82,22.86 125.48,40.51 U19.2
REGEN_3: length 45.4
  Top Layer w0.254: v1(98.68,28.32) 98.48,28.12 93.05,28.12 92.87,27.94 U4.25
  Bottom Layer w0.254: v1(98.68,28.32) 111.38,28.32 126.11,43.05 U19.3
RTS: length 18.6
  Top Layer w0.254: Q1.2 33.7,27.11 33.18,26.59 29.81,26.59 29.29,27.11 28.64,27.11 v1(28.32,27.43) ; v1(28.96,29.34) 30.1,29.34 30.37,29.61 R8.1 28.7,30.35 27.05,32 U6.14
  Bottom Layer w0.254: v1(28.96,29.34) 28.32,28.7 v1(28.32,27.43)
SD_CD: length 34
  Top Layer w0.254: R32.1 65.25,22.51 65.95,21.81 65.95,17.49 70.49,12.95 86.11,12.95 88.77,15.62 89.62,15.62 U4.34
WE1: length 13.3
  Top Layer w0.254: 129.79,63.5 126.87,60.58 120.27,60.58 119.82,61.02 119.82,62.93
WE2: length 13.7
  Top Layer w0.254: 129.79,60.96 128.65,59.82 120.01,59.82 119.19,60.64 U13.5
WE3: length 15
  Top Layer w0.254: U13.6 118.55,59.76 119.51,58.8 127.51,58.8 127.89,58.42 129.79,58.42
WE_MUX_0: length 38.4
  Top Layer w0.254: v1(116.08,62.87) 114.1,60.89 104.45,60.89 104.27,60.71 SW2.9 104.27,55.88 103.89,55.5 99.95,55.5 99.26,56.19 99.26,59.36 SW2.13 ; U13.1 121.73,63.82 122.05,64.14 123.06,64.14 123.32,63.88 v1(123.32,62.99) 123.35,62.95 TP21.1
  Bottom Layer w0.254: v1(123.32,62.99) 116.21,62.99 v1(116.08,62.87)
WE_MUX_1: length 39.1
  Top Layer w0.254: TP22.1 v1(122.05,55.37) 121.73,55.69 U13.16 ; v1(97.92,56.52) SW2.14 ; v1(102.49,56.13) 103,56.64 SW2.10 103.12,59.56 103.12,61.34 103.63,61.85 111.94,61.85 v1(112.27,61.52)
  Bottom Layer w0.254: v1(122.05,55.37) 116.59,55.37 112.27,59.69 v1(112.27,61.52) ; v1(102.49,56.13) 98.3,56.13 v1(97.92,56.52)
$1N3181: length 38.2
  Top Layer w0.5: 48.4,66.29 48.26,66.16 48.26,65.02 46.99,63.75 SW1.5 ; 48.4,66.29 44.58,66.29 ; 48.4,66.29 54.74,66.29 66.42,77.98 72.39,77.98
$1N3306: length 40.1
  Top Layer w0.5: 72.39,80.52 65.53,80.52 52.58,67.56 SW1.8 42.34,67.56 42.16,67.38 42.16,65.66 42.8,65.02 SW1.6
$1N4229: length 7.7
  Top Layer w0.254: 61.59,88.59 R16.2 59.06,88.67 59.06,90.3 57.56,91.79 U10.7
$2N1160: length 6.9
  Top Layer w0.254: USBC1.A5 10.19,65.69 13.08,68.58 13.08,69.1
$2N1249: length 5.1
  Top Layer w0.254: USBC1.B5 9.7,62.69 11.3,61.09 R2.2
$2N1352: length 22.8
  Top Layer w0.5: USBC1.0 2.92,68.77 2.92,67.94 2.54,67.56 2.54,61.98 2.92,61.6 2.92,60.12 USBC1.1 7.09,58.66 6.8,58.36 R3.1 C4.1
$2N1683: length 4.3
  Top Layer w0.254: R5.2 21.21,65.53 21.46,65.79 21.46,67.24 U5.8
$2N1687: length 4.3
  Top Layer w0.254: R4.2 21.21,63.25 21.46,62.99 21.46,61.53 U5.9
$2N1704: length 6.1
  Top Layer w1: L3.1 5.14,76.68 L2.2 8.15,73.79 C1.2
$2N1813: length 14.1
  Top Layer w0.254: 22.77,63.29 22.12,62.64 U5.10 ; 22.77,63.29 U5.11 ; 22.77,63.29 22.77,63.41 v1(23.75,64.39) ; 24.83,70.06 24.89,70.12 ; 24.72,69.95 U5.3 24.72,65.57 v1(24.77,65.53) ; C5.2 24.56,69.92 TP9.1
  Bottom Layer w0.254: v1(24.77,65.53) 24.77,65.41 v1(23.75,64.39)
$2N3429: length 2.3
  Top Layer w0.254: U8.8 34.51,50.82 R14.1
$2N6221: length 2.6
  Top Layer w0.5: LED1.1 35.24,40.41 R29.2
$3N962: length 2.6
  Top Layer w0.254: Q1.1 33.57,28.11 33.02,27.56 R7.2
$3N966: length 2.6
  Top Layer w0.254: R8.2 33.15,30.35 33.44,30.65 Q2.1
$3N1119: length 2.5
  Top Layer w0.254: Q1.3 38.57,27.61 R9.1
$3N1124: length 2.5
  Top Layer w0.254: Q2.3 38.57,30.15 R10.1
$3N1946: length 6.8
  Top Layer w0.254: R11.2 12.83,33.27 9.68,30.13 USBC2.A5
$3N1959: length 5.4
  Top Layer w0.254: USBC2.B5 9.57,27.13 10.8,25.91 R12.2
$3N1980: length 26
  Top Layer w0.5: USBC2.1 6.97,21.03 C12.1 6.62,20.69 R13.1
  Top Layer w1: USBC2.1 6.89,24.48 1.87,24.48 1.21,25.15 1.21,32.58 1.78,33.15 2.73,33.15 USBC2.3 USBC2.0
$3N1995: length 6
  Top Layer w1: 8.2,37.77 8,37.98 L6.2 5.01,40.62 4.93,40.69
$4N789: length 10.9
  Top Layer w0.254: C17.2 111.44,2.22 111.32,2.1
  Top Layer w0.5: L10.2 111.15,9.21 U4.2
  Top Layer w1: C17.2 111.33,4.43 L10.2
$4N4126: length 8.4
  Top Layer w0.5: LED4.2 100.97,34.16 103.76,31.37 R30.2
$4N4284: length 4.7
  Top Layer w0.5: LED5.2 101.22,31.24 101.6,30.86 R31.2

## Copper pours and planes (outline as drawn; the poured copper is in the pictures)
GND on Top Layer: 0.13,103 145.16,103 145.16,-0.25 0.13,-0.25
GND on Bottom Layer: -0.25,102.62 145.41,102.62 145.41,-0.51 -0.25,-0.51

## Text on the board
Bottom Silkscreen Layer: PC | ESP | ARG | BBL UTT | V0825.02 | Wireless Pico MUX | IO | REG | RE | CE | WE
Top Silkscreen Layer: RESET | BOOT | ESP | PICO | REGEN3 | REGEN2 | REGEN1 | GND | GPIO16 | GPIO15 | CE1 | CE2 | CE3 | RE3 | RE2 | RE1 | WE1 | WE2 | WE3
